# EAGLE design MastersProjectTestBed (EAGLE 9.4.2)
DESIGNER: Sean Alling; REVISION: 1.0

## Sheet 1 of 5: Table Of Contents
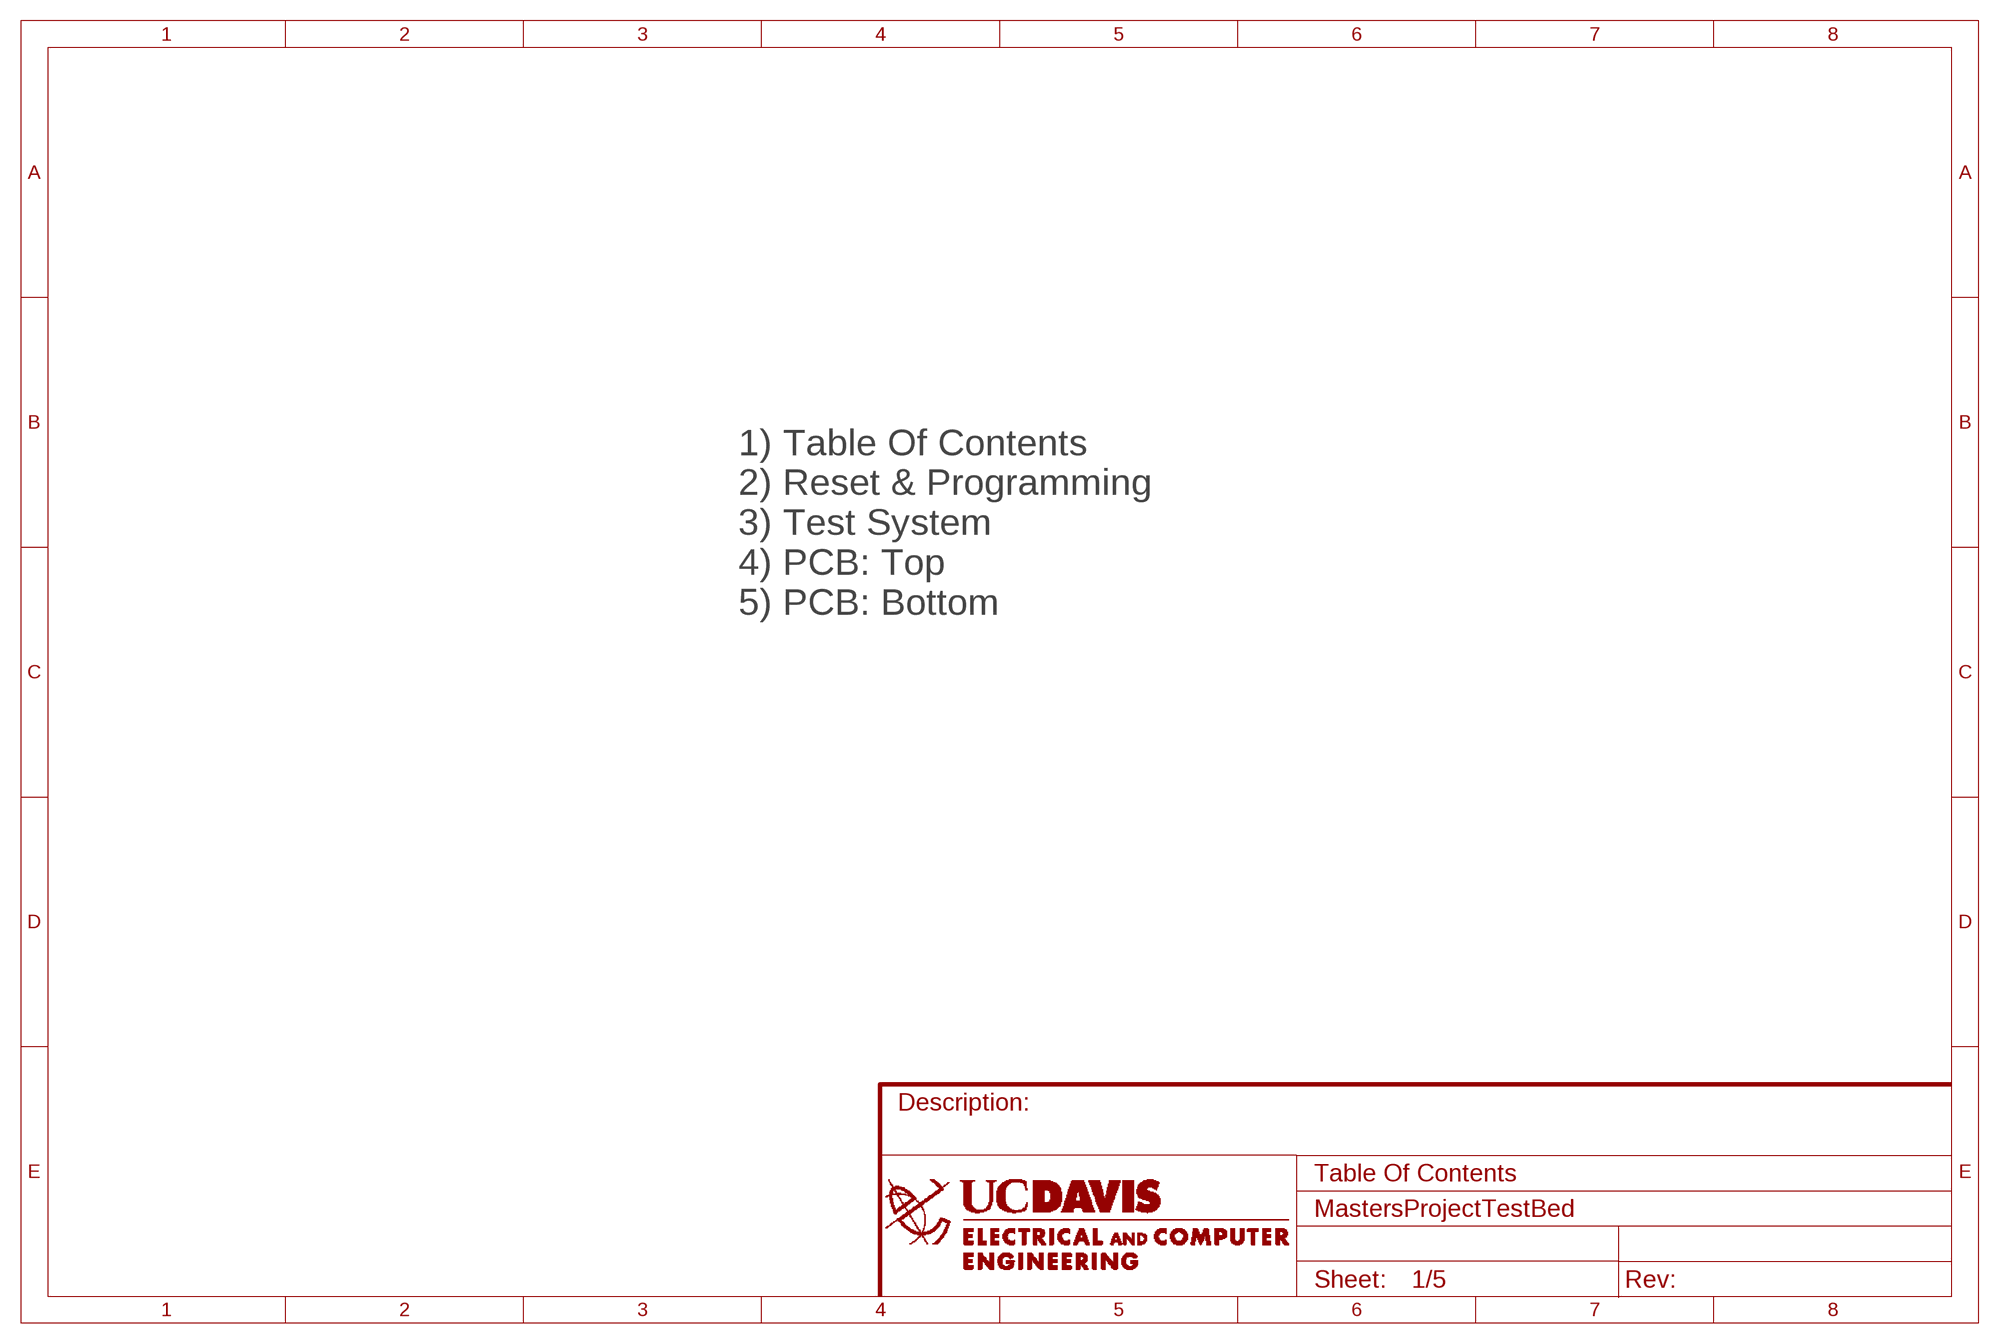
[diagram p0: schematic, sheet 1]

### Notes on the sheet
- 1) Table Of Contents
  2) Reset & Programming
  3) Test System
  4) PCB: Top
  5) PCB: Bottom

## Sheet 2 of 5: Reset & Programming
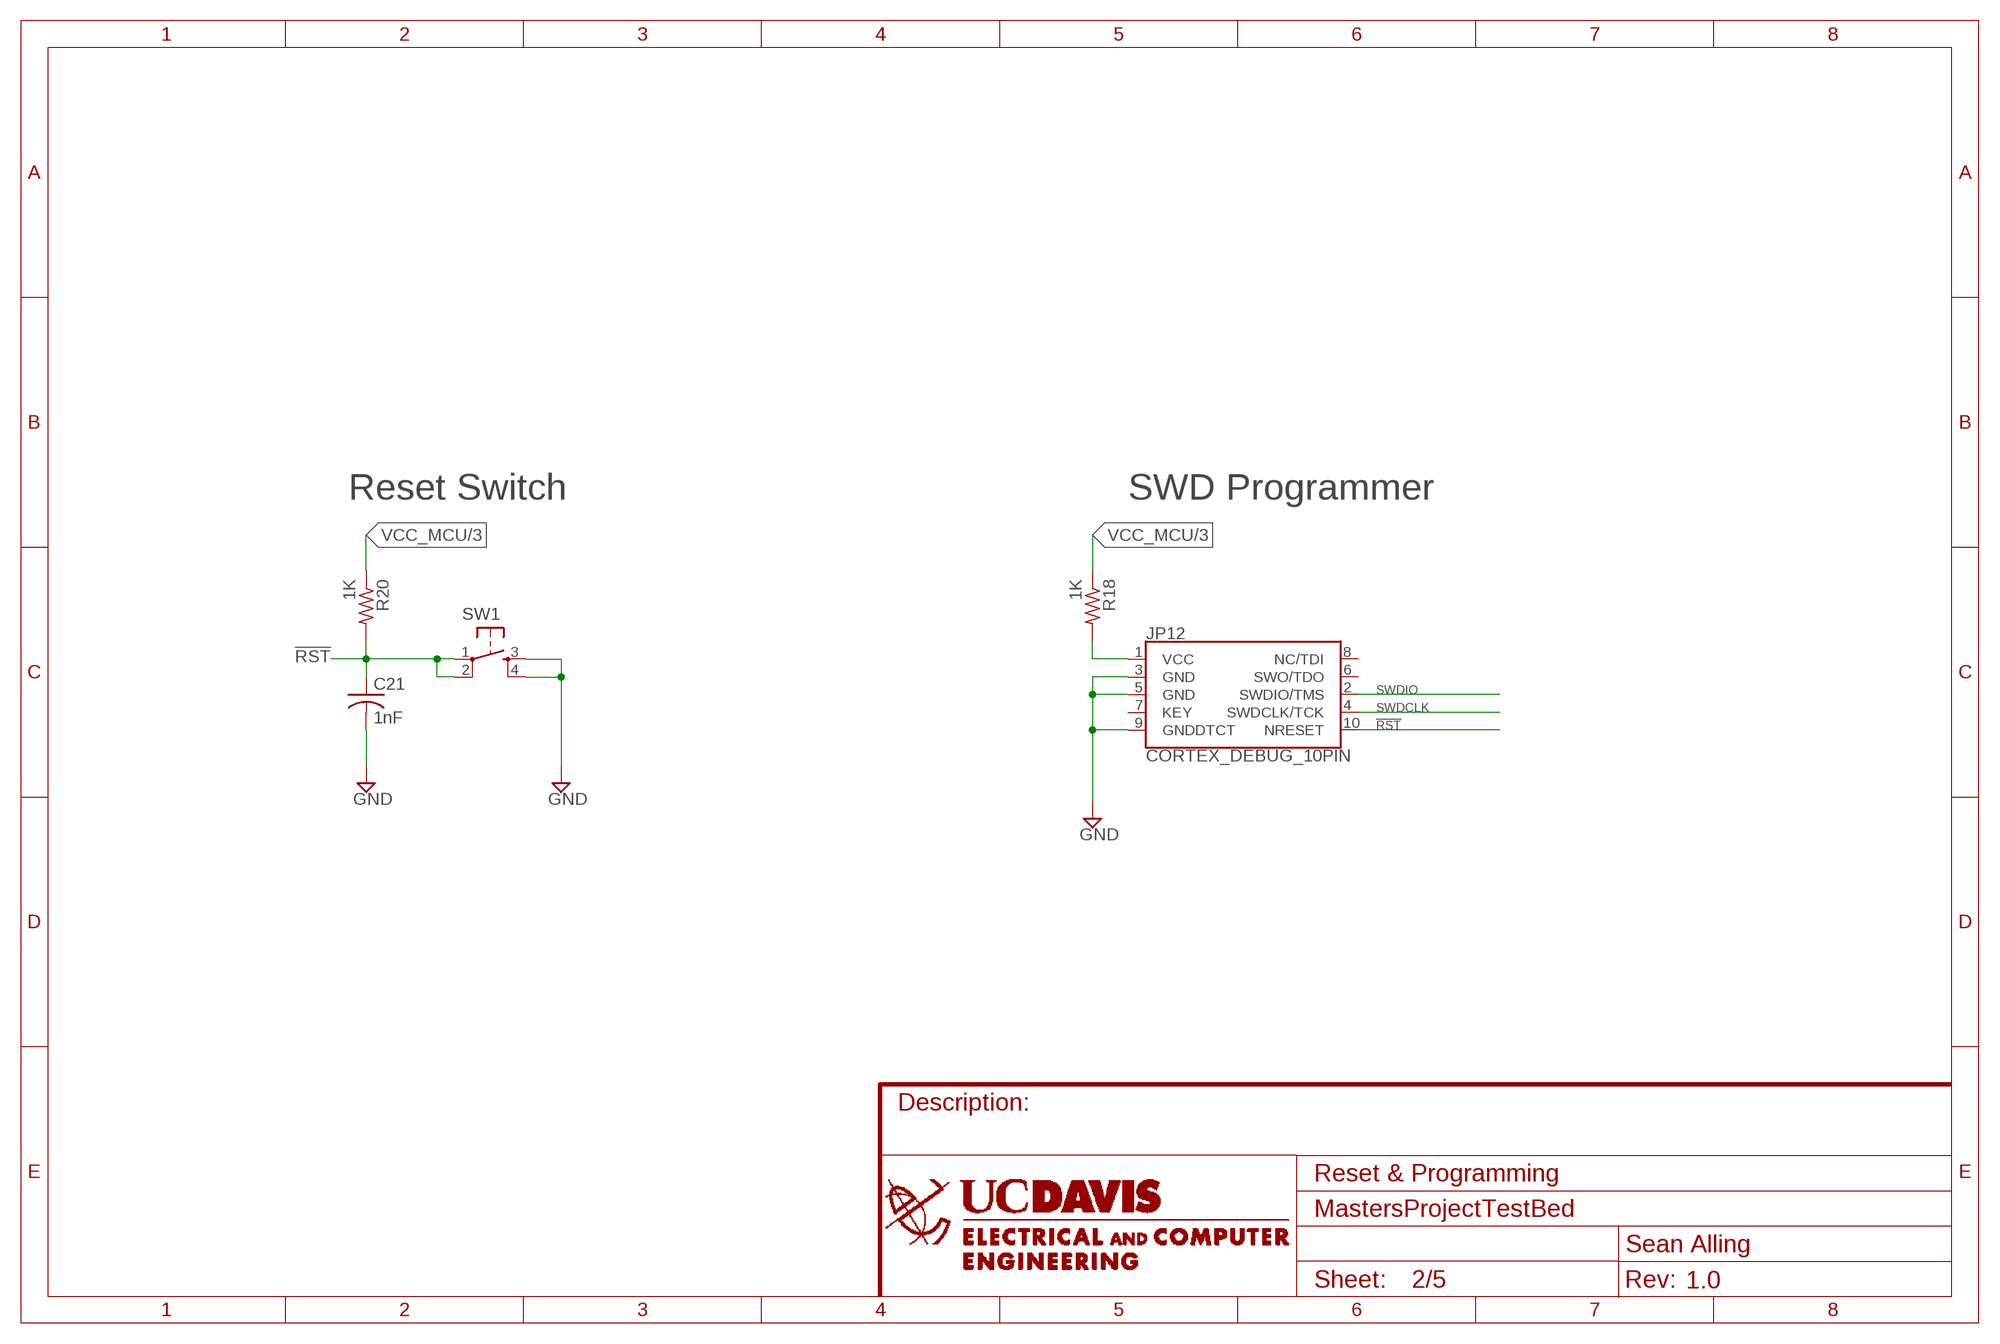
[diagram p1: schematic, sheet 2]

### Parts
C21  1nF  C-USC0603  [C0603]
JP12  CORTEX_DEBUG_10PIN  [CORTEX_DEBUG_10PIN]
R18  1K  R-US_R0603  [R0603]
R20  1K  R-US_R0603  [R0603]
SW1  TACTILE-SWITCH-SMT  [7914G]

### Nets
!RST: C21.1 JP12.10(NRESET) R20.2 SW1.1 SW1.2
GND: C21.2 JP12.3(GND) JP12.5(GND) JP12.9(GNDDTCT) SW1.3 SW1.4 ; also sheet 3
N$1: JP12.1(VCC) R18.2
SWDCLK: JP12.4(SWDCLK/TCK) ; also sheet 3
SWDIO: JP12.2(SWDIO/TMS) ; also sheet 3
VCC_MCU: R18.1 R20.1 ; also sheet 3
Unconnected: JP12.6(SWO/TDO) JP12.7(KEY) JP12.8(NC/TDI)

### Notes on the sheet
- Reset Switch | SWD Programmer

## Sheet 3 of 5: Test System
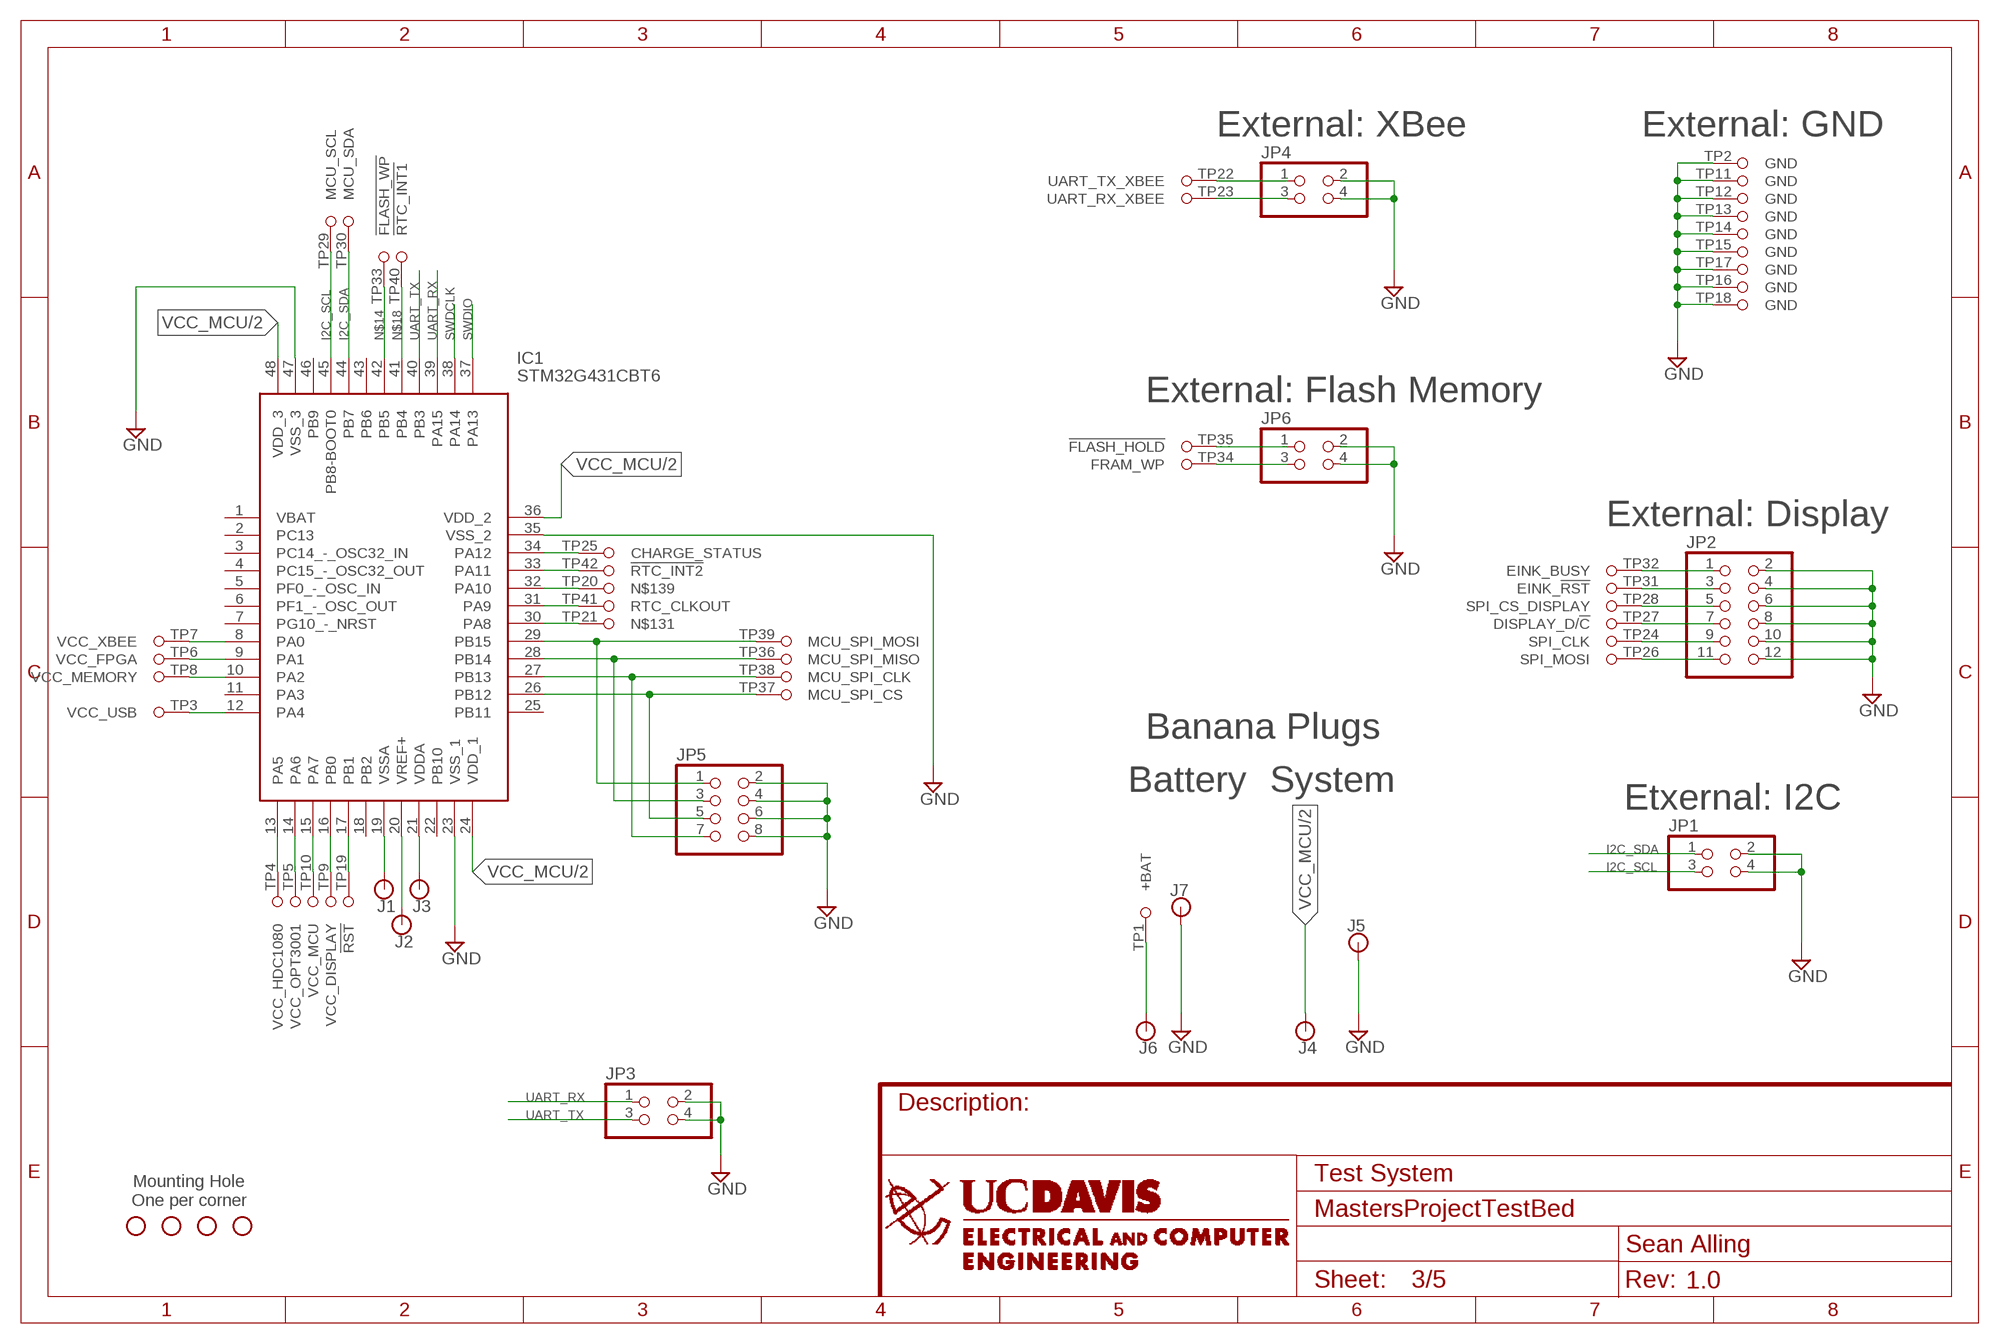
[diagram p2: schematic, sheet 3]

### Parts
H1  STAND-OFF  [STAND-OFF]
H2  STAND-OFF  [STAND-OFF]
H3  STAND-OFF  [STAND-OFF]
H4  STAND-OFF  [STAND-OFF]
IC1  STM32G431CBT6  [QFP50P900X900X160-48N]
J1  BANANA_CONN  [BANANA_CONN]
J2  BANANA_CONN  [BANANA_CONN]
J3  BANANA_CONN  [BANANA_CONN]
J4  BANANA_CONN  [BANANA_CONN]
J5  BANANA_CONN  [BANANA_CONN]
J6  BANANA_CONN  [BANANA_CONN]
J7  BANANA_CONN  [BANANA_CONN]
JP1  PINHD-2X2/90  [2X02/90]
JP2  PINHD-2X6/90  [2X06/90]
JP3  PINHD-2X2/90  [2X02/90]
JP4  PINHD-2X2/90  [2X02/90]
JP5  PINHD-2X4/90  [2X04/90]
JP6  PINHD-2X2/90  [2X02/90]
TP1  PCB-POGO  [PCB-POGO]

### Nets
GND: IC1.23(VSS_1) IC1.35(VSS_2) IC1.47(VSS_3) J5.P$1 J7.P$1 JP1.2 JP1.4 JP2.2 JP2.4 JP2.6 JP2.8 JP2.10 JP2.12 JP3.2 JP3.4 JP4.2 JP4.4 JP5.2 JP5.4 JP5.6 JP5.8 JP6.2 JP6.4 TP1.TP2 TP1.TP11 TP1.TP12 TP1.TP13 TP1.TP14 TP1.TP15 TP1.TP16 TP1.TP17 TP1.TP18 ; also sheet 2
I2C_SCL: IC1.45(PB8-BOOT0) JP1.3 TP1.TP29
I2C_SDA: IC1.44(PB7) JP1.1 TP1.TP30
N$2: IC1.9(PA1) TP1.TP6
N$3: IC1.8(PA0) TP1.TP7
N$4: IC1.10(PA2) TP1.TP8
N$5: J6.P$1 TP1.TP1
N$6: IC1.12(PA4) TP1.TP3
N$7: IC1.33(PA11) TP1.TP42
N$8: IC1.34(PA12) TP1.TP25
N$9: IC1.13(PA5) TP1.TP4
N$10: IC1.14(PA6) TP1.TP5
N$11: IC1.15(PA7) TP1.TP10
N$12: IC1.17(PB1) TP1.TP19
N$13: IC1.30(PA8) TP1.TP21
N$14: IC1.42(PB5) TP1.TP33
N$15: JP6.1 TP1.TP35
N$16: JP6.3 TP1.TP34
N$17: IC1.16(PB0) TP1.TP9
N$18: IC1.41(PB4) TP1.TP40
N$19: IC1.32(PA10) TP1.TP20
N$20: IC1.31(PA9) TP1.TP41
N$21: JP2.9 TP1.TP24
N$22: JP2.11 TP1.TP26
N$23: JP2.7 TP1.TP27
N$24: JP2.5 TP1.TP28
N$25: JP2.3 TP1.TP31
N$26: JP2.1 TP1.TP32
N$27: JP4.1 TP1.TP22
N$28: JP4.3 TP1.TP23
N$29: IC1.29(PB15) JP5.1 TP1.TP39
N$30: IC1.28(PB14) JP5.3 TP1.TP36
N$31: IC1.27(PB13) JP5.7 TP1.TP38
N$32: IC1.26(PB12) JP5.5 TP1.TP37
N$34: IC1.19(VSSA) J1.P$1
N$35: IC1.20(VREF+) J2.P$1
N$36: IC1.21(VDDA) J3.P$1
SWDCLK: IC1.38(PA14) ; also sheet 2
SWDIO: IC1.37(PA13) ; also sheet 2
UART_RX: IC1.39(PA15) JP3.1
UART_TX: IC1.40(PB3) JP3.3
VCC_MCU: IC1.24(VDD_1) IC1.36(VDD_2) IC1.48(VDD_3) J4.P$1 ; also sheet 2
Unconnected: IC1.1(VBAT) IC1.2(PC13) IC1.3(PC14_-_OSC32_IN) IC1.4(PC15_-_OSC32_OUT) IC1.5(PF0_-_OSC_IN) IC1.6(PF1_-_OSC_OUT) IC1.7(PG10_-_NRST) IC1.11(PA3) IC1.18(PB2) IC1.22(PB10) IC1.25(PB11) IC1.43(PB6) IC1.46(PB9)

### Notes on the sheet
- External: XBee | External: GND
- External: Flash Memory
- External: Display
- Banana Plugs
- Battery | System
- Etxernal: I2C
- Mounting Hole
  One per corner

## Sheet 4 of 5: PCB: Top
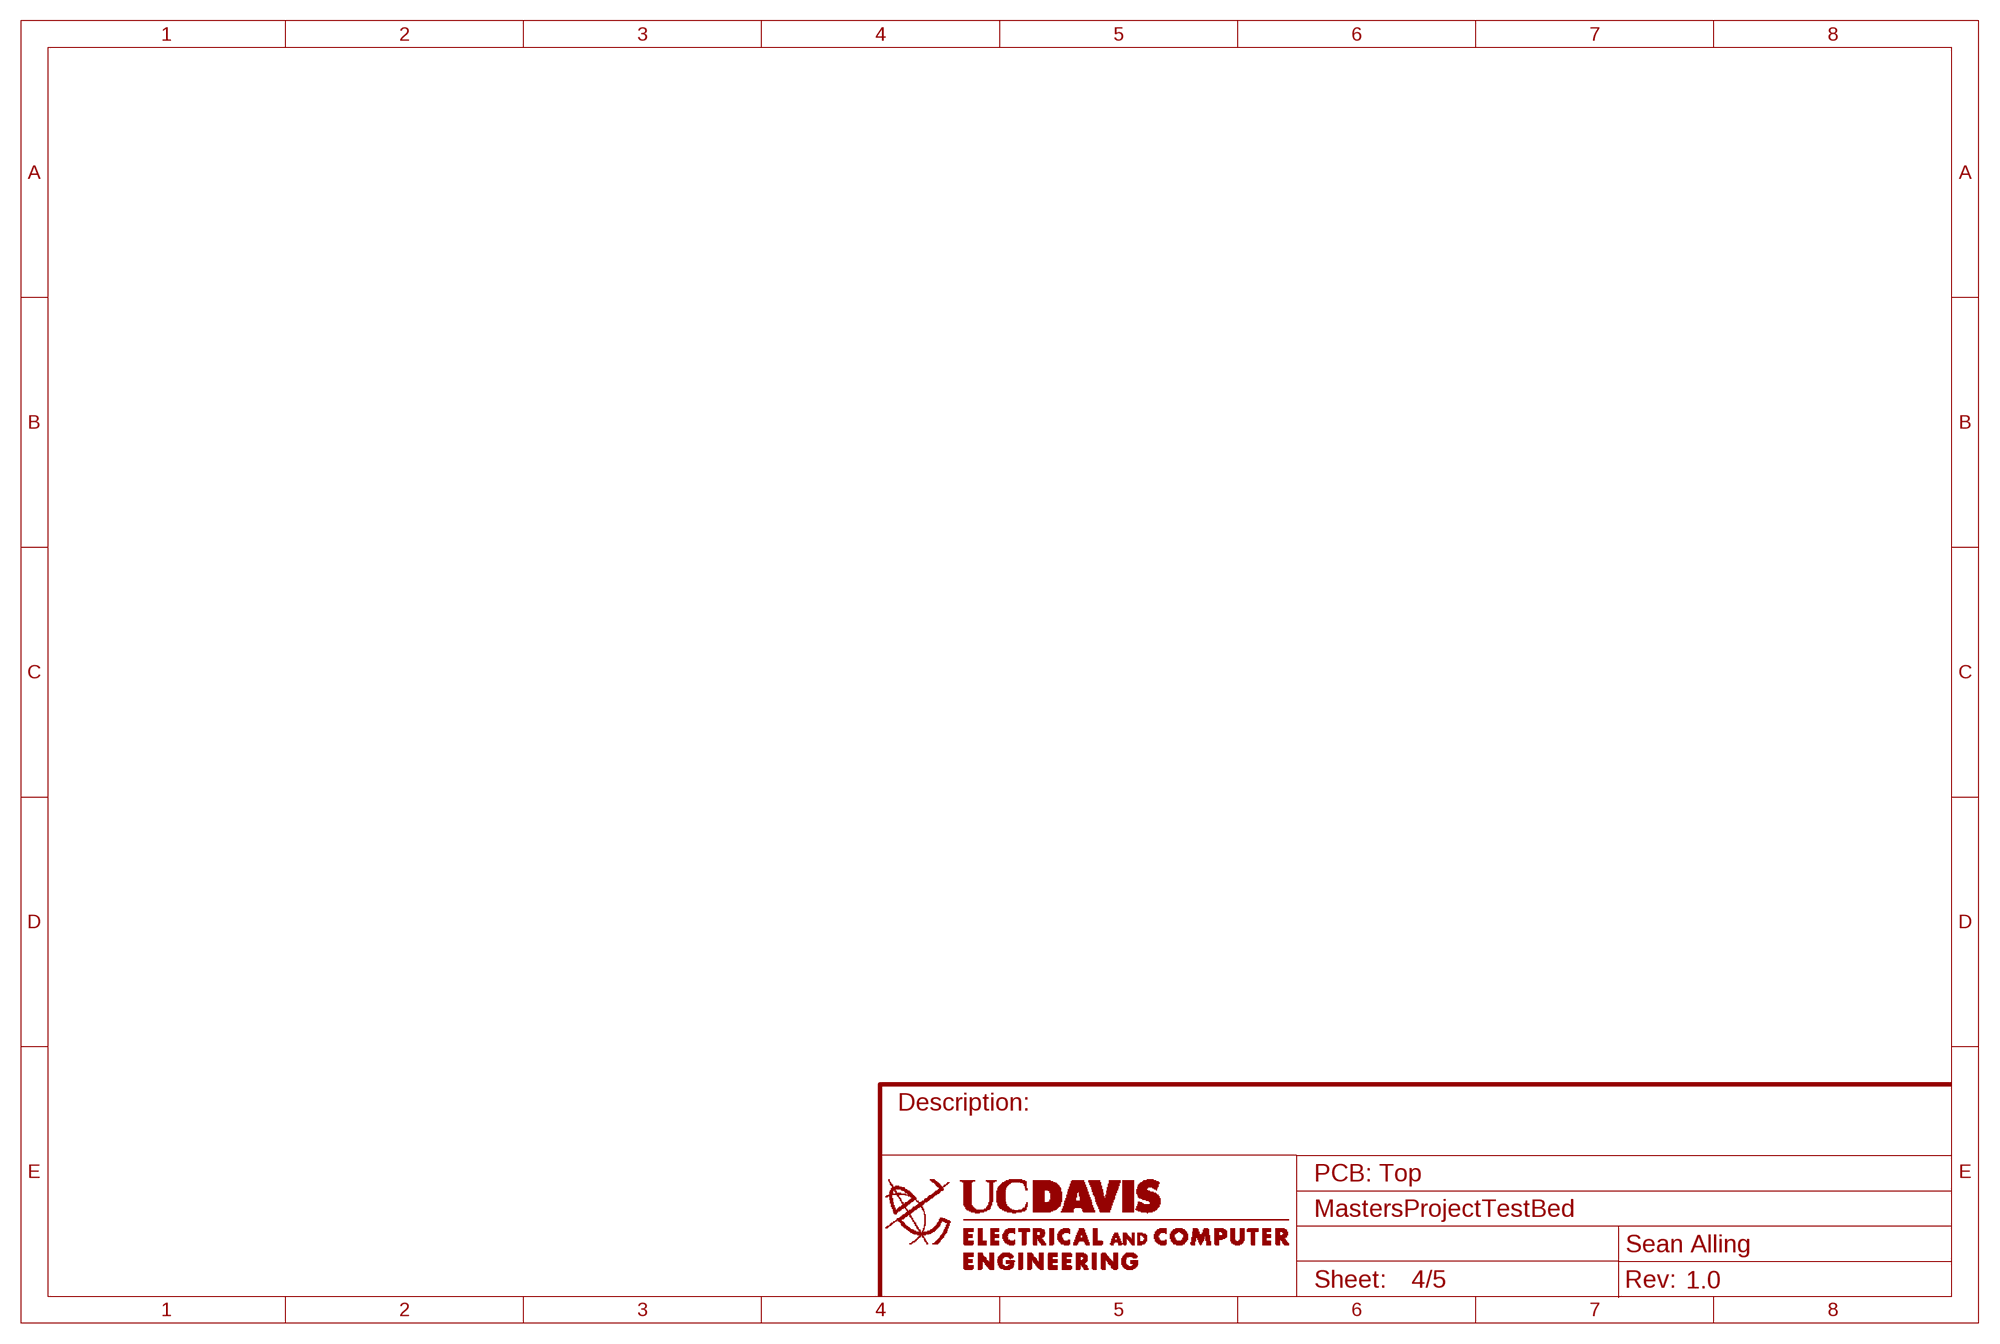
[diagram p3: schematic, sheet 4]

## Sheet 5 of 5: PCB: Bottom
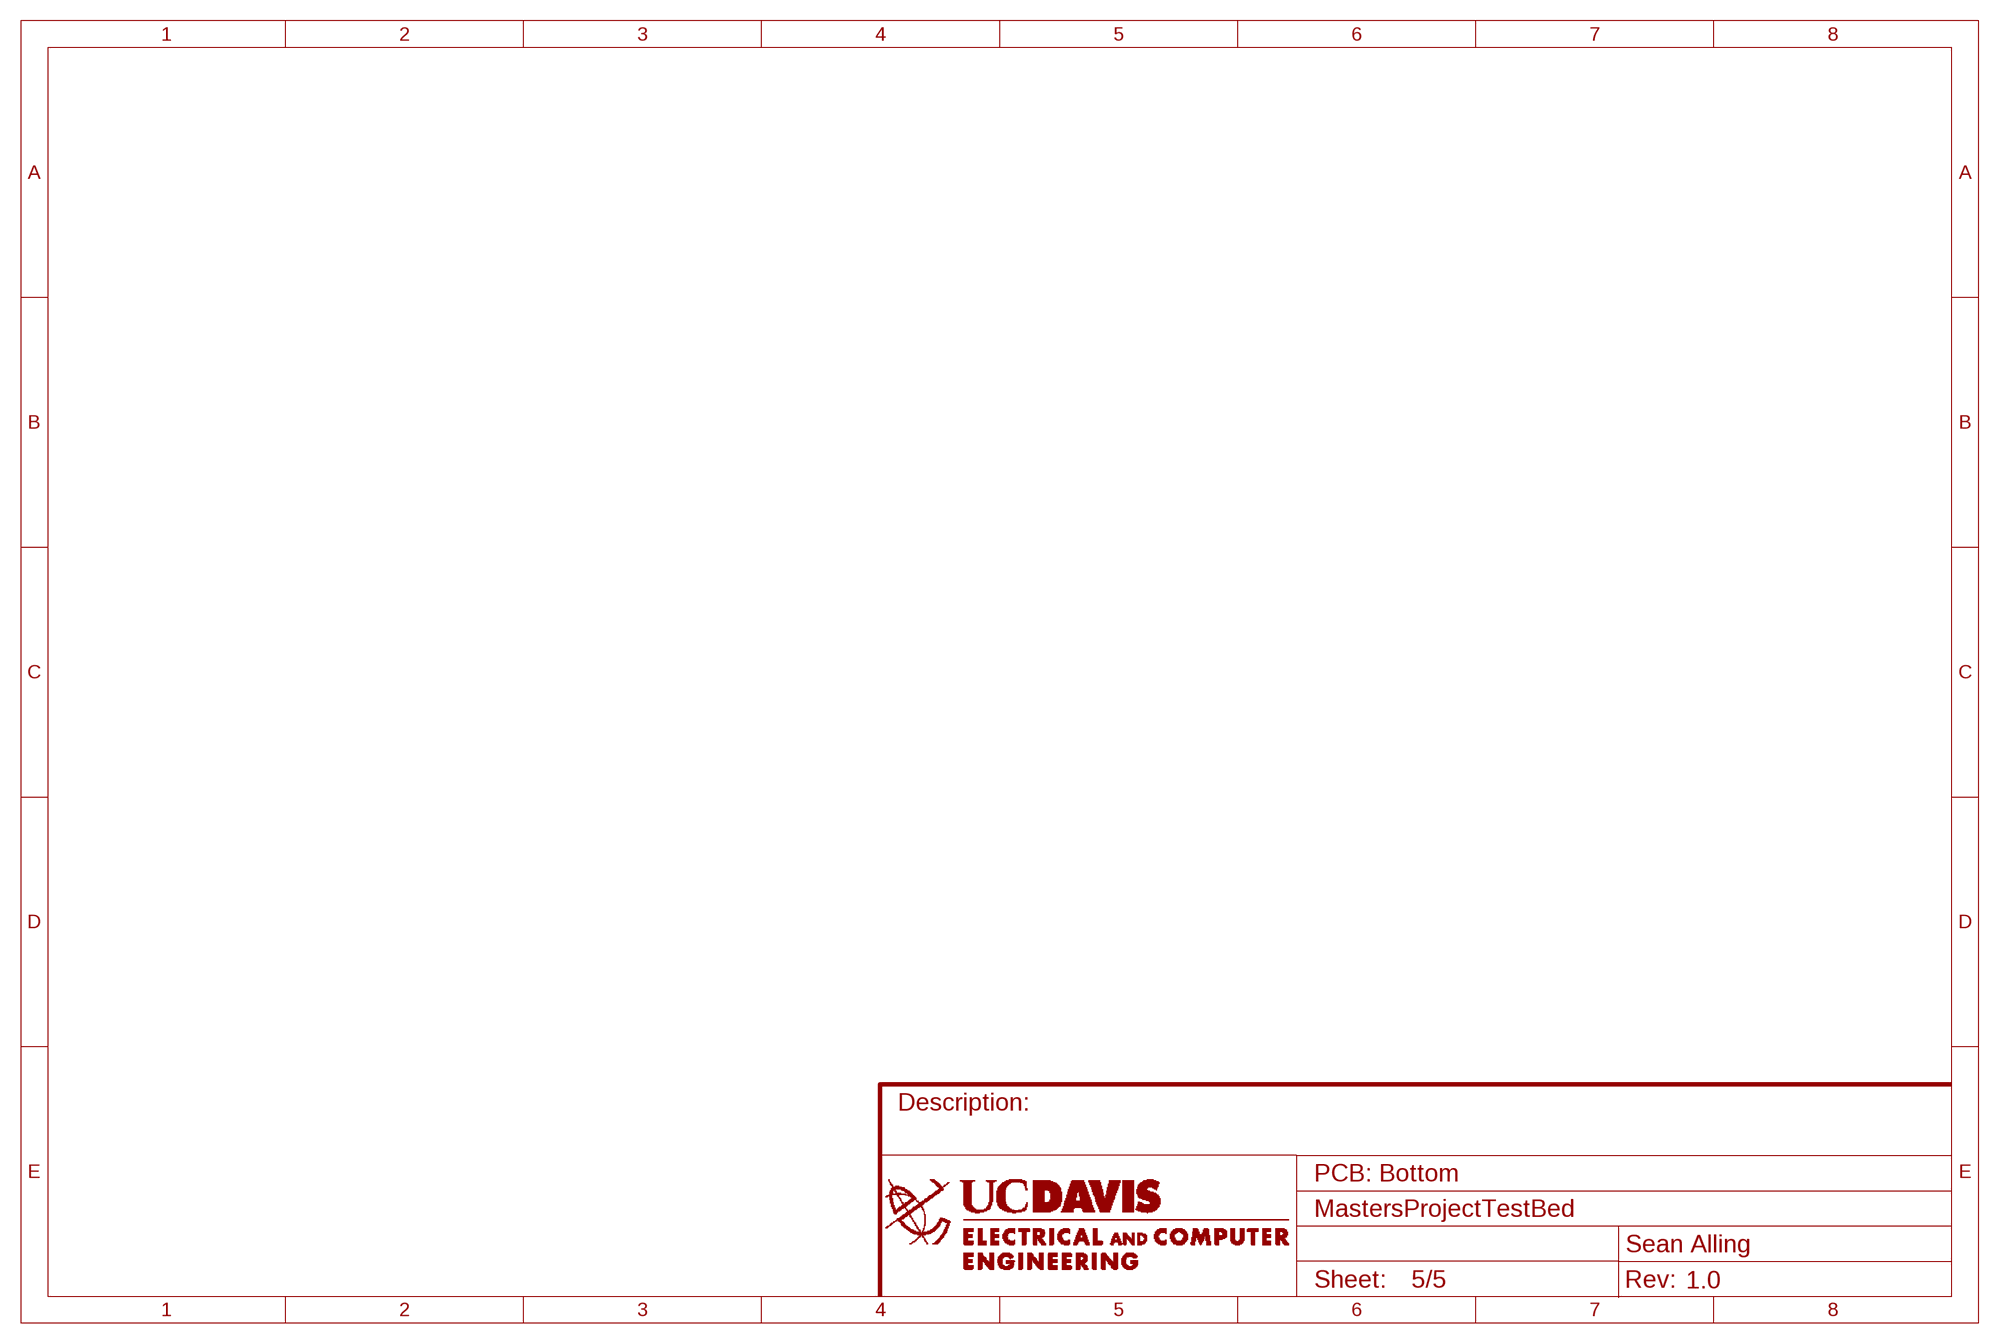
[diagram p4: schematic, sheet 5]

## Library data of the parts
C21 = rcl:C-US: CAPACITOR, American symbol; PARTNO: 08053F102K4T2A
H1-H4 = SparkFun-Hardware:STAND-OFF: Stand Off Drill holes for mechanically mounting via screws, standoffs, etc. Note: Use the keepout ring to avoid running the screw head into surrounding components. Variant Overviews STAND-OFF - Mechanical footprint for a #4 phillips button head screw. STAND-OFF-TIGHT - Mechanical footprint for a #4 phillips button head screw, Example SparkFun Products Screw - Phillips Head (1/4", 4-40, 10 pack) <https://www.sparkfun.com/products/10453> (PRT-10453) Screw - Phillips Head (1/2", 4-40, 10 pack) <https://www.sparkfun.com/products/10452> (PRT-10452) Screw - Phillips Head (3/4", 4-40, 10 pack) <https://www.sparkfun.com/products/10451> (PRT-10451) Screw - Phillips Head (1", 4-40, 10 pack) <https://www.sparkfun.com/products/10450> (PRT-10450)
IC1 = STM32G431CBT6:STM32G431CBT6: ARM Microcontrollers - MCU Mainstream Arm Cortex-M4+ MCU 170MHz with 128Kbytes of Flash memory, Math Accelerator, Medium Analog level integration Source: Datasheet <https://www.st.com/resource/en/datasheet/stm32g431cb.pdf>; DESCRIPTION: ARM Microcontrollers - MCU Mainstream Arm Cortex-M4+ MCU 170MHz with 128Kbytes of Flash memory, Math Accelerator, Medium Analog level integration; HEIGHT: 1.6mm; MANUFACTURER_NAME: STMicroelectronics; MANUFACTURER_PART_NUMBER: STM32G431CBT6; MOUSER_PART_NUMBER: 511-STM32G431CBT6; MOUSER_PRICE-STOCK: https://www.mouser.com/Search/Refine.aspx?Keyword=511-STM32G431CBT6
J1-J7 = SparkFun-Connectors:BANANA_CONN: Through-hole Banana Jack Basic PTH connection for banana jack plugs SparkFun Products: Multimeter Kit <https://www.sparkfun.com/products/retired/10956> Banana to Alligator Cable <https://www.sparkfun.com/products/retired/509> Banana to Alligator Coax Cable <https://www.sparkfun.com/products/retired/508> Banana to Banana Cable <https://www.sparkfun.com/products/retired/507> Banana to IC Hook Cables <https://www.sparkfun.com/products/retired/506>
JP1 JP3 JP4 JP6 = pinhead:PINHD-2X2: PIN HEADER
JP2 = pinhead:PINHD-2X6: PIN HEADER
JP5 = pinhead:PINHD-2X4: PIN HEADER
JP12 = MastersProject:CORTEX_DEBUG_10PIN; PARTNO: 3220-10-0100-00
R18 R20 = rcl:R-US_: RESISTOR, American symbol; PARTNO: RC0805JR-071KL
SW1 = MastersProject:TACTILE-SWITCH; PARTNO: 7914G-1-000E
TP1 = testbed:PCB-POGO: POGO PIN PCB

## Board
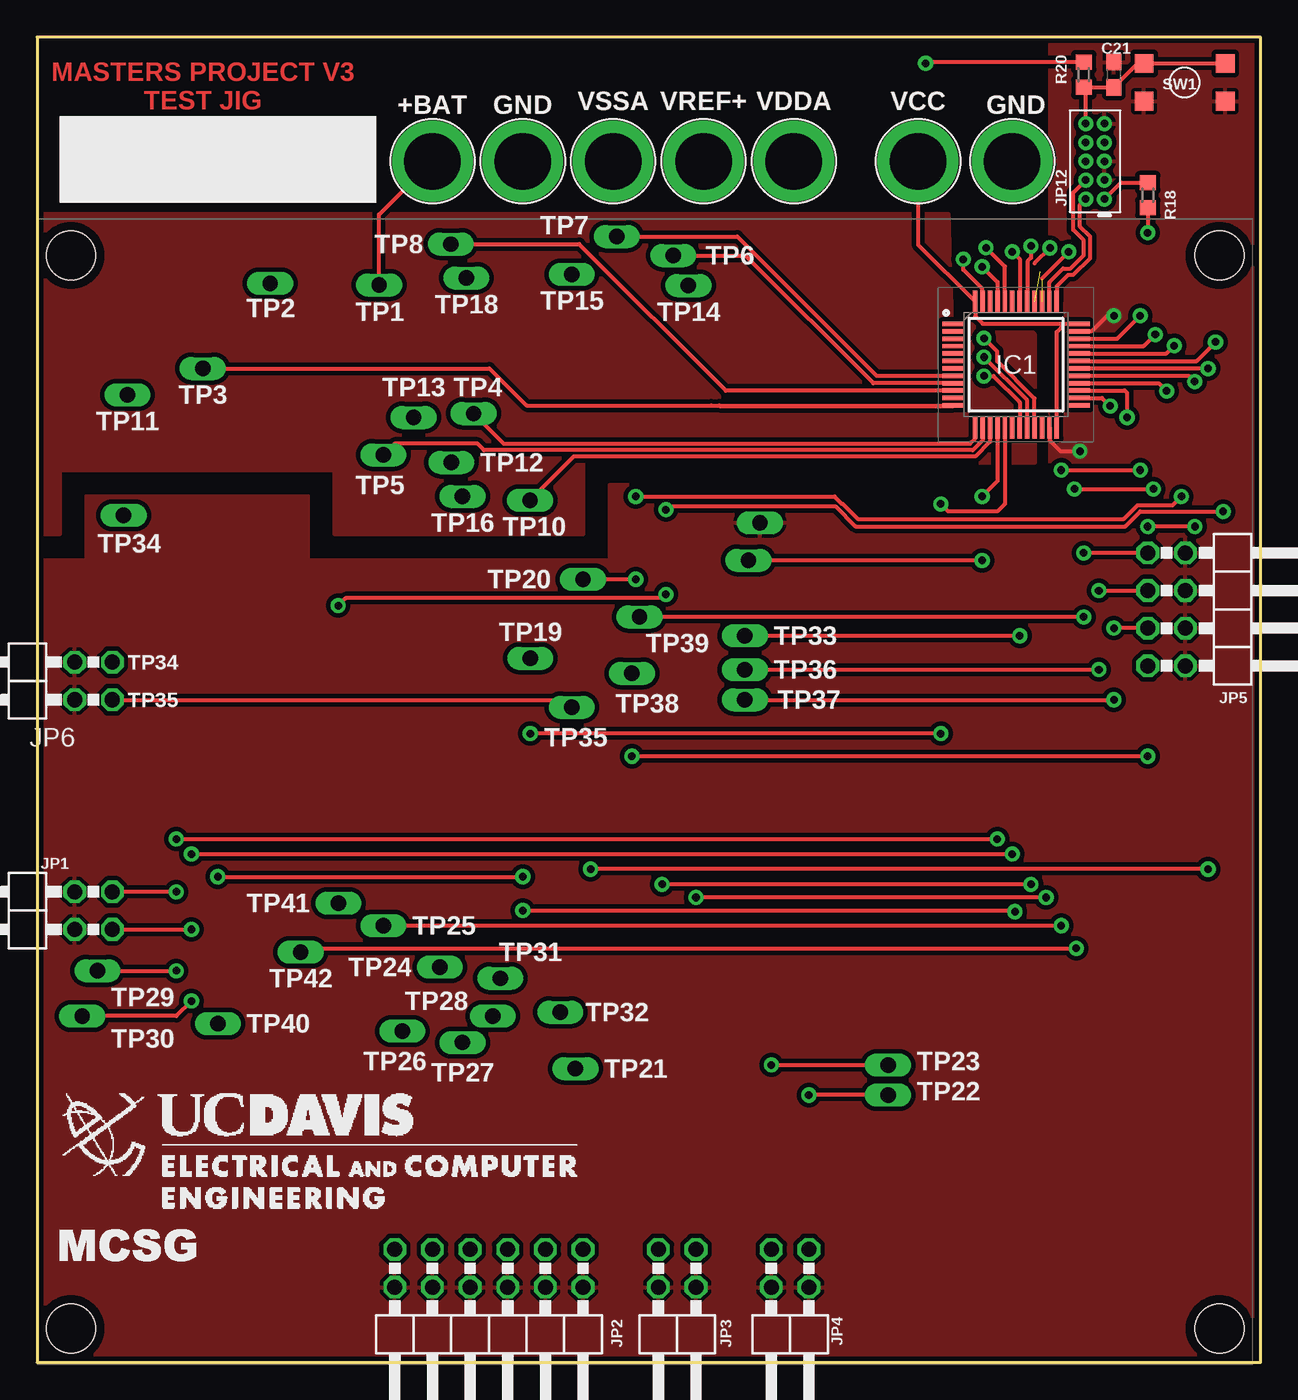
[diagram p5: board, top side]
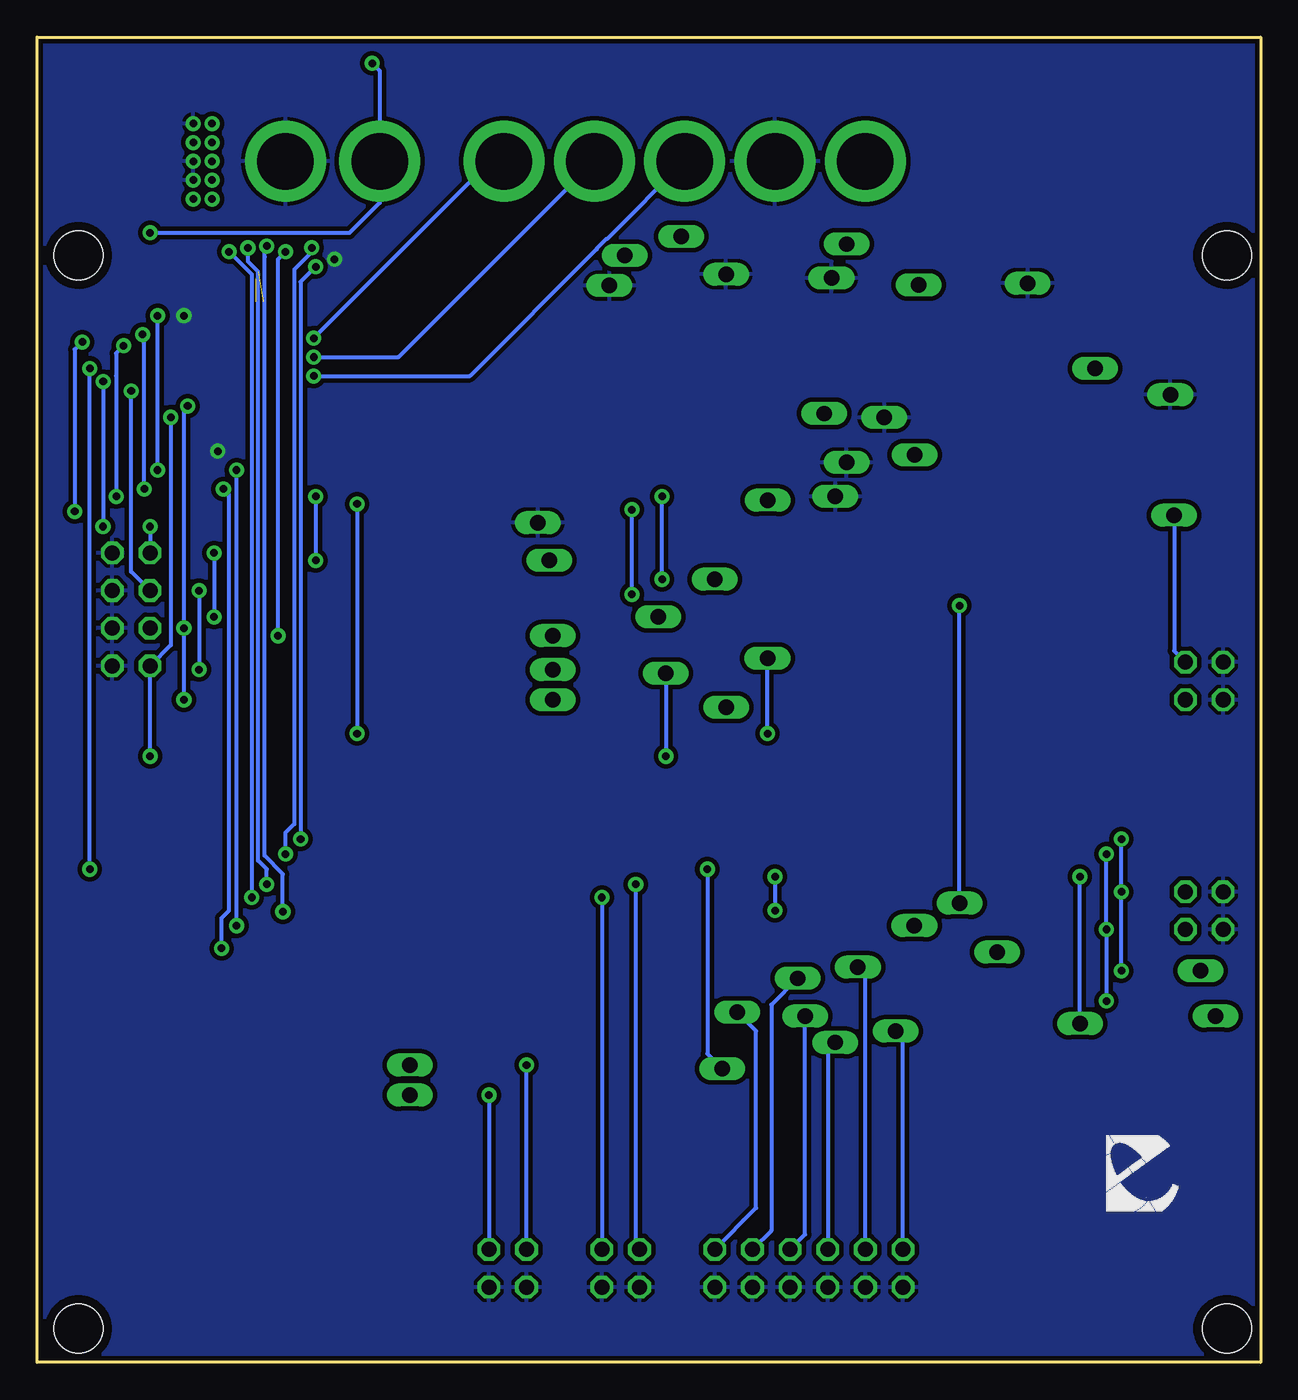
[diagram p6: board, bottom side, seen from below]

Size 82.55 x 89.41 mm. Coordinates in mm from the lower left corner, seen from the top.
Outline: 0,0 82.55,0 82.55,89.41 0,89.41 0,0
Copper layers (1*16): Top 0.035mm / dielectric 1.5mm / Bottom 0.035mm
Design rules "SparkFun-2-layer-STANDARD *": minimum track width 10mil, minimum drill 20mil, track to track 7mil, track to pad 8mil, pad to pad 8mil, via to via 10mil, smd to smd 8mil, copper to edge 8mil, drill to drill 8mil, minimum pad ring 10mil, minimum via ring 10mil, stop-mask expansion 4mil, vias tented up to drill 25mil, thermal gap 10mil

### Footprints (pad centres in the part's own frame; a part is rotated, then mirrored left to right if it is on the bottom)
C0603 = smd 1.1 x 1: 1 -0.85,0; 2 0.85,0
STAND-OFF = hole 3.302: 0,0
QFP50P900X900X160-48N = smd 1.475 x 0.3: 1 -4.238,2.75; 2 -4.238,2.25; 3 -4.238,1.75; 4 -4.238,1.25; 5 -4.238,0.75; 6 -4.238,0.25; 7 -4.238,-0.25; 8 -4.238,-0.75; 9 -4.238,-1.25; 10 -4.238,-1.75; 11 -4.238,-2.25; 12 -4.238,-2.75; 25 4.238,-2.75; 26 4.238,-2.25; 27 4.238,-1.75; 28 4.238,-1.25; 29 4.238,-0.75; 30 4.238,-0.25; 31 4.238,0.25; 32 4.238,0.75; 33 4.238,1.25; 34 4.238,1.75; 35 4.238,2.25; 36 4.238,2.75 | smd 0.3 x 1.475: 13 -2.75,-4.238; 14 -2.25,-4.238; 15 -1.75,-4.238; 16 -1.25,-4.238; 17 -0.75,-4.238; 18 -0.25,-4.238; 19 0.25,-4.238; 20 0.75,-4.238; 21 1.25,-4.238; 22 1.75,-4.238; 23 2.25,-4.238; 24 2.75,-4.238; 37 2.75,4.238; 38 2.25,4.238; 39 1.75,4.238; 40 1.25,4.238; 41 0.75,4.238; 42 0.25,4.238; 43 -0.25,4.238; 44 -0.75,4.238; 45 -1.25,4.238; 46 -1.75,4.238; 47 -2.25,4.238; 48 -2.75,4.238
BANANA_CONN = drill 3.81 pad 5.461: P$1 0,0
2X02/90 = drill 1.016 octagon: 1 -1.27,-6.35; 2 -1.27,-3.81; 3 1.27,-6.35; 4 1.27,-3.81
2X06/90 = drill 1.016 octagon: 1 -6.35,-6.35; 2 -6.35,-3.81; 3 -3.81,-6.35; 4 -3.81,-3.81; 5 -1.27,-6.35; 6 -1.27,-3.81; 7 1.27,-6.35; 8 1.27,-3.81; 9 3.81,-6.35; 10 3.81,-3.81; 11 6.35,-6.35; 12 6.35,-3.81
2X04/90 = drill 1.016 octagon: 1 -3.81,-6.35; 2 -3.81,-3.81; 3 -1.27,-6.35; 4 -1.27,-3.81; 5 1.27,-6.35; 6 1.27,-3.81; 7 3.81,-6.35; 8 3.81,-3.81
CORTEX_DEBUG_10PIN = drill 0.508 pad 1: 1 -2.54,-0.635; 2 -2.54,0.635; 3 -1.27,-0.635; 4 -1.27,0.635; 5 0,-0.635; 6 0,0.635; 7 1.27,-0.635; 8 1.27,0.635; 9 2.54,-0.635; 10 2.54,0.635
R0603 = smd 1 x 1.1: 1 -0.85,0; 2 0.85,0
7914G = smd 1.27 x 1.27: 1 -1.27,-2.54; 2 -1.27,2.946; 3 1.27,-2.54; 4 1.27,2.946
PCB-POGO = drill 1.041 long: TP1 23.074,72.684; TP2 15.724,72.802; TP3 11.176,67.056; TP4 29.448,64.008; TP5 23.352,61.214; TP6 42.91,74.676; TP7 39.1,75.946; TP8 27.924,75.438; TP9 47.99,54.102; TP10 33.258,58.166; TP11 6.096,65.278; TP12 27.94,60.706; TP13 25.4,63.754; TP14 43.942,72.644; TP15 36.068,73.406; TP16 28.702,58.42; TP17 48.768,56.642; TP18 28.956,73.152; TP19 33.274,47.498; TP20 36.83,52.832; TP21 36.322,19.812; TP22 57.404,18.034; TP23 57.404,20.066; TP24 27.178,26.67; TP25 23.368,29.464; TP26 24.638,22.352; TP27 28.702,21.59; TP28 30.734,23.368; TP29 4.064,26.416; TP30 3.048,23.368; TP31 31.242,25.908; TP32 35.306,23.622; TP33 47.752,49.022; TP34 5.842,57.15; TP35 36.068,44.196; TP36 47.752,46.736; TP37 47.752,44.704; TP38 40.132,46.482; TP39 40.64,50.292; TP40 12.192,22.86; TP41 20.32,30.988; TP42 17.78,27.686

### Placement (x,y rotation side)
C21  72.64,86.87 90 top
H1  2.29,74.68 0 top
H2  2.29,2.29 0 top
H3  79.76,2.29 0 top
H4  79.76,74.68 0 top
IC1  66.04,67.31 0 top
J1  38.86,81.03 0 top
J2  44.96,81.03 0 top
J3  51.05,81.03 0 top
J4  59.44,81.03 0 top
J5  65.79,81.03 0 top
J6  26.67,81.03 0 top
J7  32.77,81.03 0 top
JP1  -1.27,30.48 90 top
JP2  30.48,1.27 180 top
JP3  43.18,1.27 180 top
JP4  50.8,1.27 180 top
JP5  81.28,50.8 270 top
JP6  -1.27,45.97 90 top
JP12  71.37,81.03 90 top
R18  74.93,78.74 90 top
R20  70.61,86.87 270 top
SW1  77.22,86.36 270 top
TP1  0,0 0 top
U$1  [UC_DAVIS_ENG]  10.67,9.91 0 bottom
U$2  [MCSG_SMALL]  1.52,6.86 0 top
U$3  [UC_DAVIS_EEC]  1.78,10.41 0 top

### Tracks (layer width: path | path; a pad name or v marks a point on that pad's centre or on a via)
!RST
  Top 0.254: JP12.10 70.74,85.89 R20.2 C21.1 74.26,87.63 SW1.1 SW1.2
ANG_GND
  pour Top (isolate 0.305): 0,77.47 61.47,77.47 61.72,70.1 66.55,70.1 67.31,69.34 67.31,60.71 36.83,60.71 36.83,55.88 20.07,55.88 20.07,60.2 1.52,60.2 1.52,55.88 0,55.88
GND  (via drill 0.51)
  Top 0.254: IC1.23 68.31,63.05 68.31,62.2 69.04,61.47 v70.36,61.47 | IC1.35 70.3,69.58 71.15,69.58 72.18,70.61 v72.64,70.61 | IC1.47 63.77,71.57 63.77,72.42 62.48,73.71 v62.48,74.42
  pour Top (isolate 0.305, rank 2): -0.51,54.1 -0.51,0 88.14,0 88.14,89.41 68.33,89.41 68.33,59.18 38.61,59.18 38.61,54.1 18.29,54.1 18.29,58.42 3.3,58.42 3.3,54.1
  pour Bottom (isolate 0.305): -0.51,102.36 -0.51,0 83.06,0 83.06,102.36
I2C_SCL  (via drill 0.51)
  Top 0.254: v9.4,35.31 v64.77,35.31 | v63.75,73.91 64.79,72.88 IC1.45 | TP1.TP29 v9.4,26.42 | v9.4,31.75 JP1.3
  Bottom 0.254: v63.75,73.91 64.77,72.9 v64.77,35.31 | v9.4,26.42 v9.4,31.75 v9.4,35.31
I2C_SDA  (via drill 0.51)
  Top 0.254: v10.41,34.29 v65.79,34.29 | JP1.1 v10.41,29.21 | v10.41,24.38 9.4,23.37 TP1.TP30 | v64.02,75.19 65.29,73.92 IC1.44
  Bottom 0.254: v10.41,34.29 v10.41,29.21 v10.41,24.38 | v65.79,34.29 65.79,35.74 65.2,36.32 65.2,73.72 64.02,74.91 v64.02,75.19
N$1
  Top 0.254: JP12.1 73.11,79.59 R18.2
N$2
  Top 0.254: TP1.TP6 47.8,74.68 56.42,66.05 IC1.9
N$3
  Top 0.254: TP1.TP7 47.24,75.95 56.63,66.56 IC1.8
N$4
  Top 0.254: TP1.TP8 36.58,75.44 46.47,65.54 61.8,65.54 IC1.10
N$5
  Top 0.254: TP1.TP1 23.07,77.43 J6.P$1
N$6
  Top 0.254: TP1.TP3 30.52,67.06 33.03,64.55 45.47,64.55 46.02,64.55 | 46.02,64.55 46.05,64.53 61.8,64.53 | 46.02,64.55 IC1.12
N$7  (via drill 0.51)
  Top 0.254: TP1.TP42 18.03,27.94 v70.1,27.94 | v69.98,58.93 v75.31,58.93 | IC1.33 74.66,68.56 v75.44,69.34
  Bottom 0.254: v69.98,58.93 69.6,58.55 69.6,30.48 70.1,29.97 v70.1,27.94 | v75.31,58.93 75.31,69.22 v75.44,69.34
N$8  (via drill 0.51)
  Top 0.254: TP1.TP25 v69.09,29.46 | v69.09,60.2 v74.42,60.2 | IC1.34 72.87,69.06 v74.42,70.61
  Bottom 0.254: v69.09,29.46 v69.09,60.2 | v74.42,60.2 v74.42,70.61
N$9
  Top 0.254: 63.29,63.2 IC1.13 63.29,62.33 62.94,61.98 31.48,61.98 TP1.TP4
N$10
  Top 0.254: TP1.TP5 23.87,61.73 23.95,61.82 24.11,61.98 29.72,61.98 30.15,61.54 63.12,61.54 63.79,62.22 IC1.14
N$11
  Top 0.254: IC1.15 64.29,62.11 63.3,61.11 36.2,61.11 TP1.TP10
N$12  (via drill 0.51)
  Top 0.254: IC1.17 65.29,57.92 65.28,57.91 64.77,57.4 61.47,57.4 v60.96,57.91 | v60.96,42.42 v33.27,42.42
  Bottom 0.254: v60.96,57.91 v60.96,42.42 | v33.27,42.42 TP1.TP19
N$13  (via drill 0.51)
  Top 0.254: IC1.30 72.9,67.06 | 72.9,67.06 73.02,67.06 | v78.99,33.27 v37.34,33.27 | v78.99,67.06 72.9,67.06
  Bottom 0.254: v37.34,33.27 37.34,20.83 TP1.TP21 | v78.99,33.27 v78.99,67.06
N$14  (via drill 0.51)
  Top 0.254: TP1.TP33 v66.29,49.02 | v65.79,74.93 66.29,74.43 IC1.42
  Bottom 0.254: v66.29,49.02 66.29,74.42 v65.79,74.93
N$15
  Top 0.254: JP6.1 35.56,44.7 TP1.TP35
N$16
  Bottom 0.254: TP1.TP34 5.84,48.01 JP6.3
N$17  (via drill 0.51)
  Top 0.254: IC1.16 64.79,59.46 v63.75,58.42 | v63.75,54.1 TP1.TP9
  Bottom 0.254: v63.75,58.42 v63.75,54.1
N$18  (via drill 0.51)
  Top 0.254: v12.19,32.77 v32.77,32.77 | v32.77,30.48 65.89,30.48 v65.97,30.41 | v67.06,75.31 67.06,74.53 66.81,74.28 66.81,71.57 IC1.41
  Bottom 0.254: TP1.TP40 v12.19,32.77 | v32.77,32.77 v32.77,30.48 | v67.06,75.31 67.18,75.18 67.18,74.56 67.21,74.54 67.21,34.19 65.97,32.95 v65.97,30.41
N$19  (via drill 0.51)
  Top 0.254: IC1.32 76.19,68.06 v76.71,68.58 | TP1.TP20 v40.39,52.83 | v40.39,58.42 53.79,58.42 54.3,57.91 54.36,57.91 55.37,56.9 73.3,56.9 74.24,57.84 76.61,57.84 v77.2,58.42
  Bottom 0.254: v76.71,68.58 77.22,68.07 77.22,66.55 77.2,66.53 v77.2,58.42 | v40.39,52.83 v40.39,58.42
N$20  (via drill 0.51)
  Top 0.254: IC1.31 78.23,67.56 v79.5,68.83 | v42.42,57.53 42.64,57.75 53.85,57.75 55.21,56.39 73.41,56.39 74.42,57.4 v80.01,57.4 | v42.42,51.82 42.16,51.56 20.83,51.56 v20.32,51.05
  Bottom 0.254: v79.5,68.83 80.01,68.33 v80.01,57.4 | TP1.TP41 v20.32,51.05 | v42.42,51.82 v42.42,57.53
N$21
  Bottom 0.254: JP2.9 26.67,26.16 TP1.TP24
N$22
  Bottom 0.254: JP2.11 24.13,21.84 TP1.TP26
N$23
  Bottom 0.254: TP1.TP27 29.21,21.08 JP2.7
N$24
  Bottom 0.254: JP2.5 30.73,8.64 TP1.TP28
N$25
  Bottom 0.254: TP1.TP31 33.02,24.13 33.02,8.89 JP2.3
N$26
  Bottom 0.254: JP2.1 34.04,10.41 34.04,22.35 TP1.TP32
N$27  (via drill 0.51)
  Top 0.254: TP1.TP22 v52.07,18.03
  Bottom 0.254: v52.07,18.03 JP4.1
N$28  (via drill 0.51)
  Top 0.254: v49.53,20.07 TP1.TP23
  Bottom 0.254: JP4.3 v49.53,20.07
N$29  (via drill 0.51)
  Top 0.254: JP5.1 v70.61,54.61 | v70.61,50.29 TP1.TP39 | IC1.29 77.69,66.56 v78.09,66.17 | v78.11,56.39 v74.93,56.39
  Bottom 0.254: v70.61,54.61 v70.61,50.29 | v78.09,66.17 78.09,56.41 v78.11,56.39 | v74.93,56.39 JP5.1
N$30  (via drill 0.51)
  Top 0.254: 48.07,46.74 TP1.TP36 v71.63,46.74 | v71.63,52.07 JP5.3 | v76.2,65.53 75.67,66.06 IC1.28
  Bottom 0.254: v71.63,52.07 v71.63,46.74 | JP5.3 76.2,53.34 v76.2,65.53
N$31  (via drill 0.51)
  Top 0.254: IC1.27 73.38,65.56 73.53,65.41 v73.53,63.75 | v40.13,40.89 v74.93,40.89
  Bottom 0.254: TP1.TP38 v40.13,40.89 | v74.93,40.89 JP5.7 73.53,48.39 v73.53,63.75
N$32  (via drill 0.51)
  Top 0.254: 49.28,44.7 TP1.TP37 v72.64,44.7 | IC1.26 71.85,65.06 v72.39,64.52 | JP5.5 v72.64,49.53
  Bottom 0.254: v72.64,44.7 v72.64,49.53 72.64,64.26 v72.39,64.52
N$34  (via drill 0.51)
  Top 0.254: IC1.19 66.27,63.09 66.27,63.25 66.29,63.27 66.29,64.77 64.52,66.55 v63.88,66.55
  Bottom 0.254: v63.88,66.55 53.34,66.55 44.8,75.09 44.8,75.14 44.15,75.79 44.1,75.79 J1.P$1
N$35  (via drill 0.51)
  Top 0.254: IC1.20 66.79,64.91 v63.88,67.82
  Bottom 0.254: v63.88,67.82 58.17,67.82 J2.P$1
N$36  (via drill 0.51)
  Top 0.254: IC1.21 67.29,65.02 64.77,67.54 64.77,68.2 v63.88,69.09
  Bottom 0.254: J3.P$1 51.94,81.03 v63.88,69.09
SWDCLK
  Top 0.254: IC1.38 68.29,72.86 69.22,73.79 69.71,73.79 70.61,74.69 70.61,75.69 69.9,76.4 69.9,78.92 JP12.4
SWDIO
  Top 0.254: IC1.37 68.79,72.6 69.55,73.36 69.89,73.36 71.04,74.51 71.04,75.95 70.36,76.63 70.36,78.11 JP12.2
UART_RX  (via drill 0.51)  (1 unrouted)
  Top 0.254: 67.79,73.12 v69.6,74.93 | v68.07,31.37 v44.45,31.37
  Bottom 0.254: v69.6,74.93 68.07,73.41 v68.07,31.37 | v44.45,31.37 JP3.1
UART_TX  (via drill 0.51)  (1 unrouted)
  Top 0.254: v67.06,32.26 v42.16,32.26 | v68.33,75.18 67.29,74.15
  Bottom 0.254: v42.16,32.26 42.16,7.87 JP3.3 | v67.06,32.26 67.06,33.27 67.64,33.86 67.64,73.58 68.33,74.27 v68.33,75.18
VCC_MCU  (via drill 0.51)
  Top 0.254: 69.34,70.06 63.8,70.06 63.29,70.57 IC1.48 59.44,75.4 J4.P$1 | 69.34,70.06 IC1.36 | IC1.24 68.79,69.51 69.34,70.06 | R20.1 60.03,87.72 v59.94,87.63 | R18.1 v74.93,76.2
  Bottom 0.254: v59.94,87.63 59.44,87.12 J4.P$1 59.44,78.23 61.47,76.2 v74.93,76.2

### Text on the board
Top: MASTERS PROJECT V3 / TEST JIG
tPlace: TP34 | TP35
tNames: +BAT | GND | VSSA | VREF+ | VDDA | VCC | GND | TP7 | TP8 | TP6 | TP15 | TP2 | TP1 | TP18 | TP14 | TP13 | TP4 | TP3 | TP11 | TP12 | TP5 | TP16 | TP10 | TP34 | TP20 | TP19 | TP39 | TP33 | TP36 | TP37 | TP38 | TP35 | TP41 | TP25 | TP31 | TP24 | TP42 | TP29 | TP28 | TP32 | TP40 | TP30 | TP26 | TP27 | TP21 | TP23 | TP22
tValues: TP39 | TP36 | TP37 | TP38 | SCL | SDA | TP26 | TP28 | TP27 | TP28 | TP31 | TP32 | UART_TX | UART_RX | TP23 | TP22